# EAGLE design photonNixieTop (EAGLE 9.0.0)
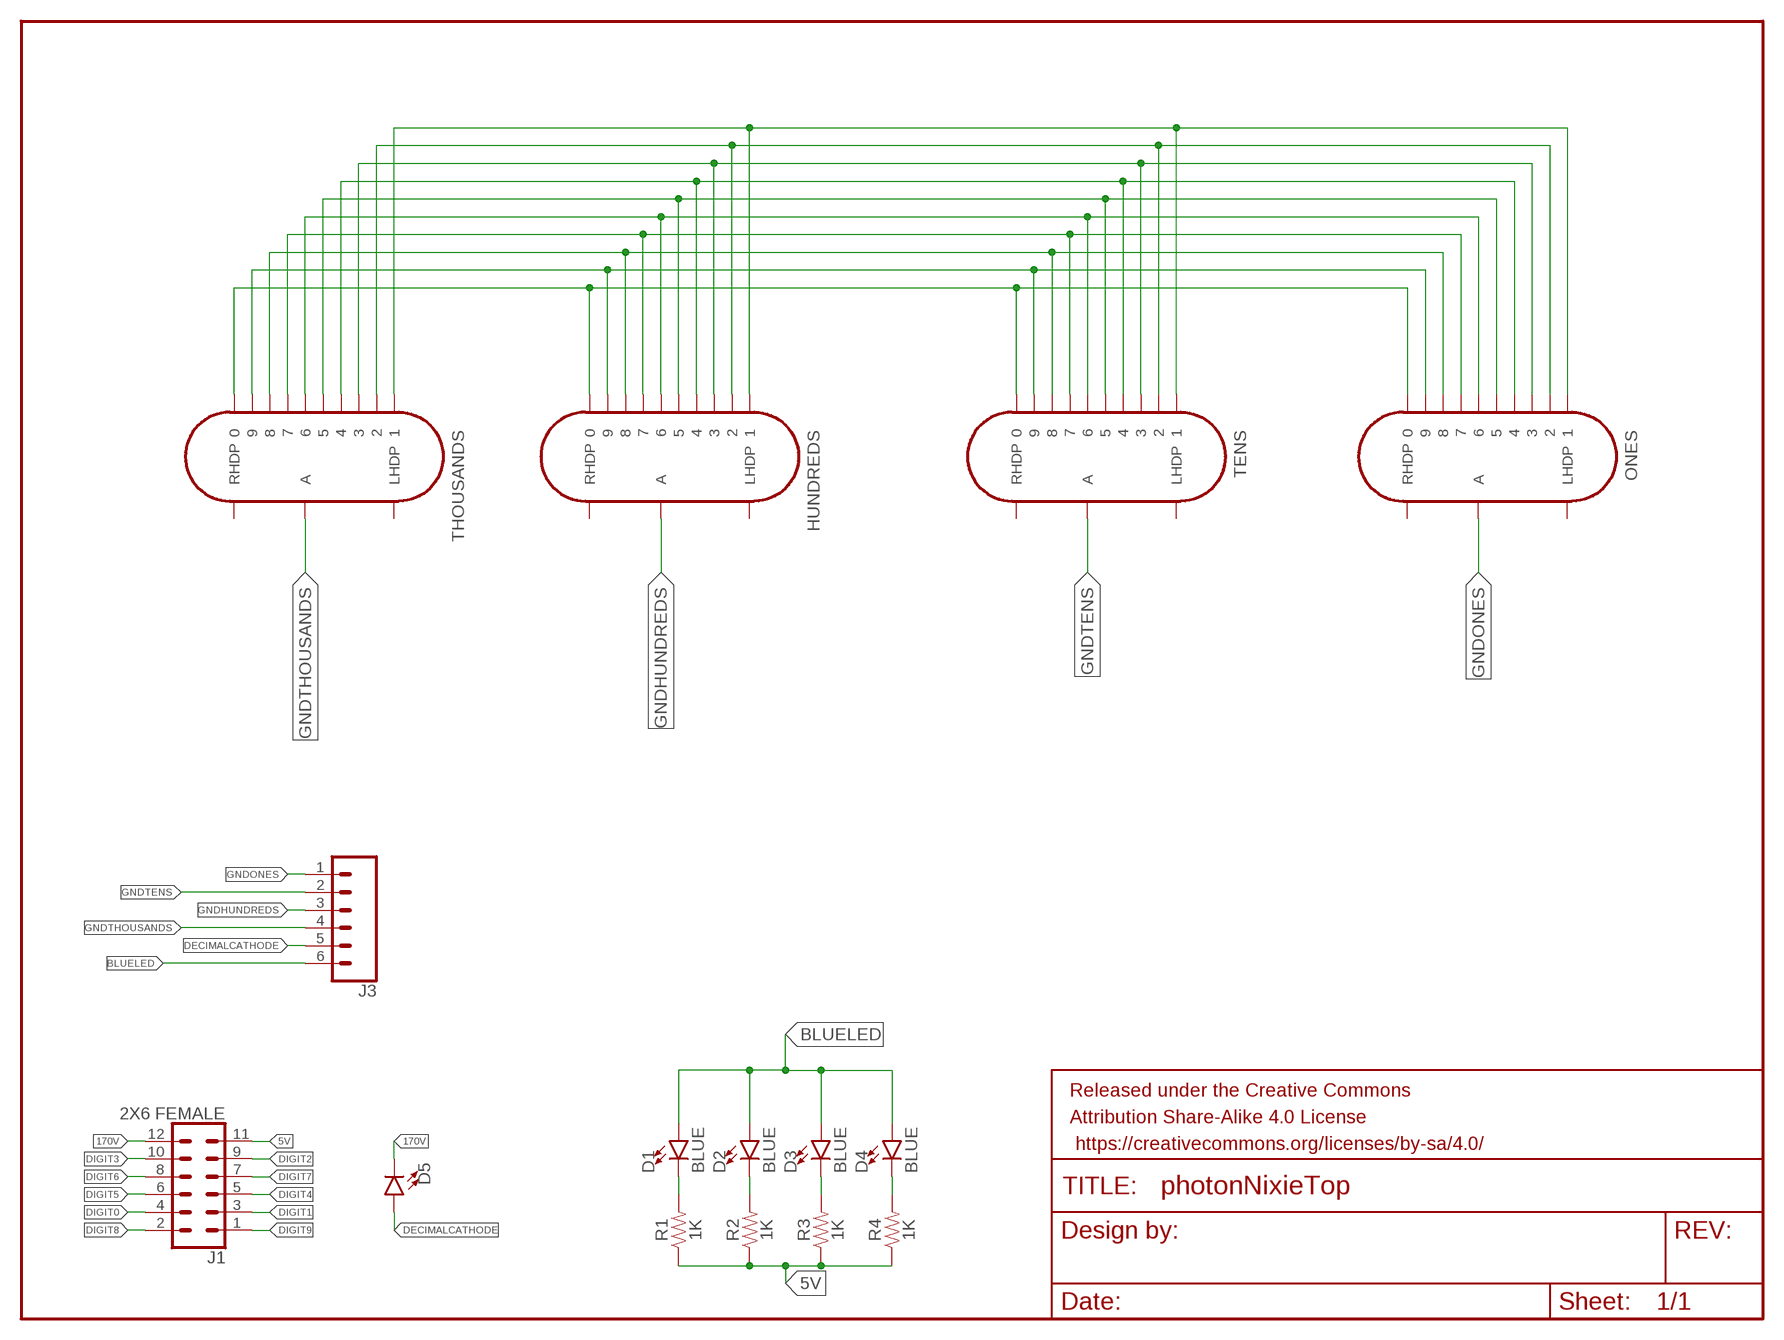
[diagram p0: schematic, sheet 1]

## Parts
D1  BLUE  LED-BLUE1206  [LED-1206]
D2  BLUE  LED-BLUE1206  [LED-1206]
D3  BLUE  LED-BLUE1206  [LED-1206]
D4  BLUE  LED-BLUE1206  [LED-1206]
D5  LED5MM  [LED_5MM]
FRAME1  FRAME-LETTER  [CREATIVE_COMMONS]
HUNDREDS  IN-14  [IN-14]
J1  2X6 FEMALE  CONN_06X2PTH_FEMALE  [2X6]
J3  CONN_06SILK_FEMALE_PTH  [1X06]
ONES  IN-14  [IN-14]
R1  1K  0.3OHM-0805-1/8W-1%  [0805]
R2  1K  0.3OHM-0805-1/8W-1%  [0805]
R3  1K  0.3OHM-0805-1/8W-1%  [0805]
R4  1K  0.3OHM-0805-1/8W-1%  [0805]
TENS  IN-14  [IN-14]
THOUSANDS  IN-14  [IN-14]

## Nets
5V: J1.11 R1.1 R2.1 R3.1 R4.1
170V: D5.K(C) J1.12
BLUELED: D1.A D2.A D3.A D4.A J3.6
DECIMALCATHODE: D5.A J3.5
DIGIT0: HUNDREDS.0 J1.4 ONES.0 TENS.0 THOUSANDS.0
DIGIT1: HUNDREDS.1 J1.3 ONES.1 TENS.1 THOUSANDS.1
DIGIT2: HUNDREDS.2 J1.9 ONES.2 TENS.2 THOUSANDS.2
DIGIT3: HUNDREDS.3 J1.10 ONES.3 TENS.3 THOUSANDS.3
DIGIT4: HUNDREDS.4 J1.5 ONES.4 TENS.4 THOUSANDS.4
DIGIT5: HUNDREDS.5 J1.6 ONES.5 TENS.5 THOUSANDS.5
DIGIT6: HUNDREDS.6 J1.8 ONES.6 TENS.6 THOUSANDS.6
DIGIT7: HUNDREDS.7 J1.7 ONES.7 TENS.7 THOUSANDS.7
DIGIT8: HUNDREDS.8 J1.2 ONES.8 TENS.8 THOUSANDS.8
DIGIT9: HUNDREDS.9 J1.1 ONES.9 TENS.9 THOUSANDS.9
GNDHUNDREDS: HUNDREDS.A J3.3
GNDONES: J3.1 ONES.A
GNDTENS: J3.2 TENS.A
GNDTHOUSANDS: J3.4 THOUSANDS.A
N$2: D4.C R4.2
N$3: D3.C R3.2
N$4: D2.C R2.2
N$5: D1.C R1.2
Unconnected: HUNDREDS.LHDP HUNDREDS.RHDP ONES.LHDP ONES.RHDP TENS.LHDP TENS.RHDP THOUSANDS.LHDP THOUSANDS.RHDP

## Library data of the parts
D1-D4 = SparkFun-LED:LED-BLUE: Blue SMD LED Used in manufacturing of various products at SparkFun Packages: 0603 - SMD 0603 package [Product Link] <http://www.digikey.com/product-detail/en/SMLE12BC7TT86/511-1589-2-ND/1641808> 1206 - SMD1206 package [Product Link] <http://www.digikey.com/product-detail/en/lite-on-inc/LTST-C150TBKT/160-1643-1-ND/573584> SparkFun Products: ESP8266 Thing-Dev Board <https://www.sparkfun.com/products/13711> RedBoard <https://www.sparkfun.com/products/12757>; PROD_ID: DIO-09911
D5 = SparkFun-LED:LED: LED (Generic) Standard schematic elements and footprints for 5mm, 3mm, 1206, and 0603 sized LEDs. Generic LEDs with no color specified.
FRAME1 = SparkFun-Aesthetics:FRAME-LETTER: Schematic Frame - Letter Standard 8.5x11 US Letter frame
HUNDREDS ONES TENS THOUSANDS = russian-nixies:IN-14: IN-14: medium numeric frontview nixie tube
J1 = SparkFun-Connectors:CONN_06X2: Multi connection point. Often used as Generic Header-pin footprint for 0.1 inch spaced/style header connections On any of the 0.1 inch spaced packages, you can populate with these: Break Away Headers - Straight <https://www.sparkfun.com/products/116> (PRT-00116) Break Away Male Headers - Right Angle <https://www.sparkfun.com/products/553> (PRT-00553) Female Headers <https://www.sparkfun.com/products/115> (PRT-00115) Break Away Headers - Machine Pin <https://www.sparkfun.com/products/117> (PRT-00117) Break Away Female Headers - Swiss Machine Pin <https://www.sparkfun.com/products/743> (PRT-00743); PROD_ID: CONN-12423
J3 = SparkFun-Connectors:CONN_06: Multi connection point. Often used as Generic Header-pin footprint for 0.1 inch spaced/style header connections On any of the 0.1 inch spaced packages, you can populate with these: Break Away Headers - Straight <https://www.sparkfun.com/products/116> (PRT-00116) Break Away Male Headers - Right Angle <https://www.sparkfun.com/products/553> (PRT-00553) Female Headers <https://www.sparkfun.com/products/115> (PRT-00115) Break Away Headers - Machine Pin <https://www.sparkfun.com/products/117> (PRT-00117) Break Away Female Headers - Swiss Machine Pin <https://www.sparkfun.com/products/743> (PRT-00743) Arduino Stackable Header - 6 Pin <https://www.sparkfun.com/products/9280> (PRT-09280) For SCREWTERMINALS and SPRING TERMINALS visit here: Screw Terimnals on SparkFun.com <https://www.sparkfun.com/search/results?term=Screw+Terminals> (5mm/3.5mm/2.54mm spacing) This device is also useful as a general connection point to wire up your design to another part of your project. Our various solder wires solder well into these plated through hole pads. Hook-Up Wire - Assortment (Stranded, 22 AWG) <https://www.sparkfun.com/products/11375> (PRT-11375) Hook-Up Wire - Assortment (Solid Core, 22 AWG) <https://www.sparkfun.com/products/11367> (PRT-11367) View the entire wire category on our website here <https://www.sparkfun.com/categories/141>; PROD_ID: CONN-08437
R1-R4 = SparkFun-Resistors:0.3OHM: 0.3Ω resistor A resistor is a passive two-terminal electrical component that implements electrical resistance as a circuit element. Resistors act to reduce current flow, and, at the same time, act to lower voltage levels within circuits. - Wikipedia; PROD_ID: RES-11622; VALUE: 0.3

## Board
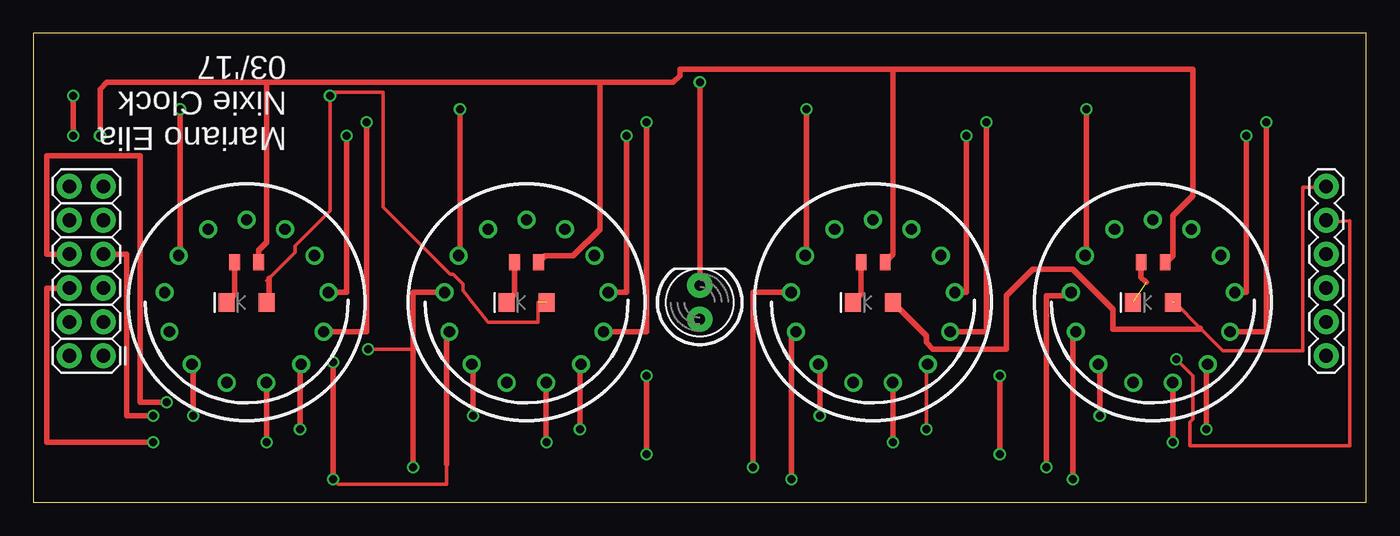
[diagram p1: board, top side]
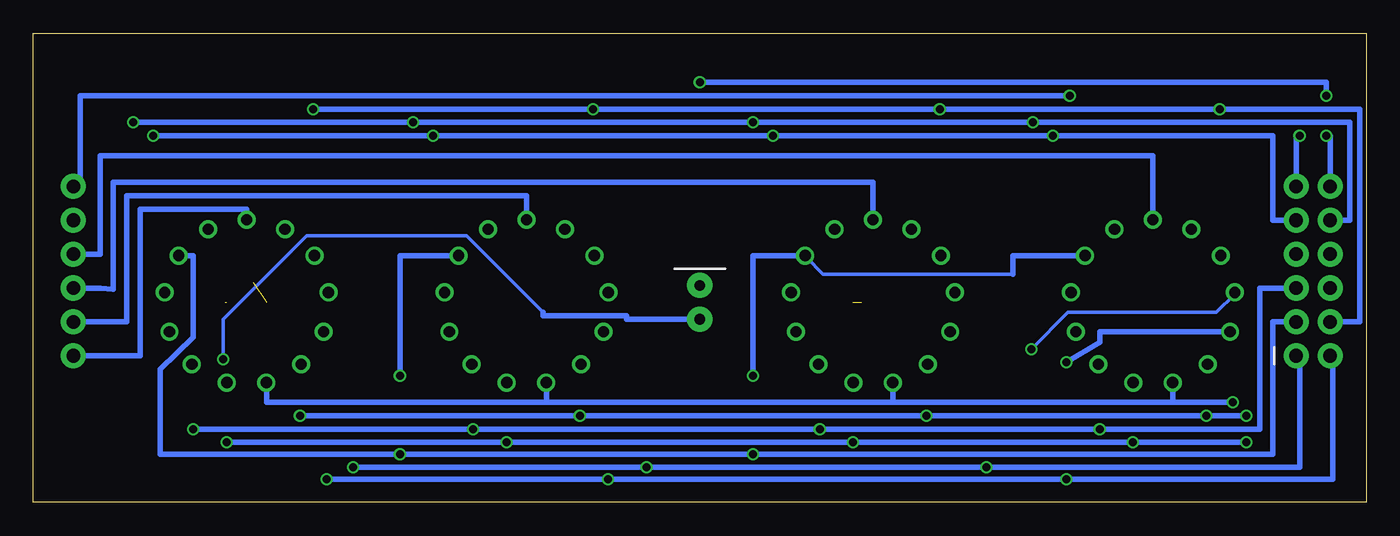
[diagram p2: board, bottom side, seen from below]

Size 100 x 35.18 mm. Coordinates in mm from the lower left corner, seen from the top.
Outline: 0,0 100,0 100,35.18 0,35.18 0,0
Copper layers (1*16): Top 0.035mm / dielectric 1.5mm / Bottom 0.035mm
Design rules "dirt_cheap_dirty_boards.v1": minimum track width 5mil, minimum drill 12mil, track to track 5mil, track to pad 5mil, pad to pad 5mil, via to via 5mil, smd to smd 0mil, copper to edge 10mil, drill to drill 10mil, minimum pad ring 10mil, minimum via ring 6mil, stop-mask expansion 2mil, vias tented up to drill 25mil, thermal gap 10mil

### Footprints (pad centres in the part's own frame; a part is rotated, then mirrored left to right if it is on the bottom)
LED-1206 = smd 1.2 x 1.4: A -1.5,0; C 1.5,0
LED_5MM = drill 0.813 pad 1.88: A -1.27,0; K 1.27,0
IN-14 = drill 0.84: 0 5.094,-3.516; 1 -5.094,-3.516; 2 -6.145,-0.746; 3 -5.788,2.195; 4 -4.105,4.633; 5 -1.481,6.01; 6 1.481,6.01; 7 4.105,4.633; 8 5.788,2.195; 9 6.145,-0.746; A 0,-6.19; LHDP 2.877,-5.481; RHDP -2.877,-5.481
2X6 = drill 1.016 pad 1.88: 1 0,0; 2 0,2.54; 3 2.54,0; 4 2.54,2.54; 5 5.08,0; 6 5.08,2.54; 7 7.62,0; 8 7.62,2.54; 9 10.16,0; 10 10.16,2.54; 11 12.7,0; 12 12.7,2.54
1X06 = drill 1.016 pad 1.88: 1 0,0; 2 2.54,0; 3 5.08,0; 4 7.62,0; 5 10.16,0; 6 12.7,0
0805 = smd 0.8 x 1.2: 1 -0.9,0; 2 0.9,0

### Placement (x,y rotation side)
D1  16,15 180 top
D2  37,15 180 top
D3  63,15 180 top
D4  84,15 180 top
D5  50,15 90 top
FRAME1  14.5,-7.5 0 top  (outside the outline)
HUNDREDS  37,15 180 top
J1  5.25,11 90 top
J3  97,11 90 top
ONES  84,15 180 top
R1  16,18 180 top
R2  37,18 180 top
R3  63,18 180 top
R4  84,18 180 top
TENS  63,15 180 top
THOUSANDS  16,15 180 top

### Tracks (layer width: path | path; a pad name or v marks a point on that pad's centre or on a via)
5V  (via drill 0.6)
  Top 0.406: v5,27.5 5,31 5.5,31.5 17.5,31.5 | R4.1 85,18 85.5,18.5 85.5,21.5 87,23 87,32.5 64.5,32.5 | 17.5,31.5 42.5,31.5 | 42.5,31.5 48,31.5 48.5,32 48.5,32.5 64.5,32.5 | R3.1 64.5,18.6 64.5,32.5 | R2.1 38.4,18.5 40.5,18.5 42.5,20.5 42.5,31.5 | R1.1 16.9,18.9 17.5,19.5 17.5,31.5
  Bottom 0.406: J1.11 5.25,27.25 v5,27.5
170V  (via drill 0.6)
  Top 0.406: v3,30.5 v3,27.5 | v50,31.5 D5.K
  Bottom 0.406: v3,30.5 3,31.5 v50,31.5 | v3,27.5 2.71,27.5 J1.12
BLUELED  (via drill 0.6)  (2 unrouted)
  Top 0.254: 17.5,16.62 17.69,16.81 19.62,18.75 19.62,19.25 22.25,21.88 v22.25,30.5 22.25,30.75 26.25,30.75 26.25,22.12 31.25,17.12 31.5,17.12 32.25,16.38 32.25,15.88 34.12,13.5 37.88,13.5 37.88,15 | 85.62,15 87.56,13.06 89.25,11.38 95.25,11.38 95.25,23.62 97,23.62 J3.6
  Top 0.406: 17.69,16.81 17.69,15.19 D1.A | D3.A 67,12.5 67,12 67.5,11.5 73,11.5 73,15.5 75,17.5 78,17.5 81,14.5 81,13 87.5,13 87.56,13.06
  Bottom 0.406: J3.6 96.5,23.7 96.5,30.5 v22.25,30.5
DECIMALCATHODE  (via drill 0.6)
  Top 0.254: v85.75,10.75 87,9.5 87,6.25 86.75,6 86.75,4.25 98.75,4.25 98.75,21.12 97,21 J3.5
  Bottom 0.254: 61.75,14.25 67.5,20 79.5,20 85.75,13.75 v85.75,10.75
  Bottom 0.406: D5.A 55.5,13.73 55.5,14 61.75,14 61.75,14.25
DIGIT0  (via drill 0.6)
  Top 0.406: ONES.0 79,18.52 v79,29.5 | TENS.0 58,18.52 v58,29.5 | HUNDREDS.0 32,18.52 v32,29.5 | THOUSANDS.0 11,18.52 v11,29.5
  Bottom 0.406: v79,29.5 v58,29.5 v32,29.5 v11,29.5 0.5,29.5 0.5,13.54 J1.4
DIGIT1  (via drill 0.6)
  Top 0.406: v46,9.5 v46,3.62 | v72.5,9.5 v72.5,3.62
  Bottom 0.254: 26.5,17.12 40.75,17.12 42,18.38 HUNDREDS.1
  Bottom 0.406: J1.3 7,13.54 7,3.62 v46,3.62 v72.5,3.62 90.5,3.62 90.5,10 88,12.38 88,18.52 ONES.1 | THOUSANDS.1 26.5,18.52 26.5,17.12 | HUNDREDS.1 46,18.52 v46,9.5 | TENS.1 72.5,18.52 v72.5,9.5
DIGIT2  (via drill 0.6)
  Top 0.406: THOUSANDS.2 23.5,15.75 v23.5,27.5 | HUNDREDS.2 44.5,15.75 v44.5,27.5 | TENS.2 70,15.75 v70,27.5 | ONES.2 91,15.75 v91,27.5
  Bottom 0.406: J1.9 7,21.16 7,27.5 v23.5,27.5 v44.5,27.5 v70,27.5 v91,27.5
DIGIT3  (via drill 0.6)
  Top 0.406: THOUSANDS.3 25,12.8 v25,28.5 | HUNDREDS.3 46,12.8 v46,28.5 | TENS.3 71.5,12.8 v71.5,28.5 | ONES.3 92.5,12.8 v92.5,28.5
  Bottom 0.406: J1.10 1.25,21.16 1.25,28.5 v25,28.5 v46,28.5 v71.5,28.5 v92.5,28.5
DIGIT4  (via drill 0.6)
  Top 0.254: v67,5.5 67,10.25 TENS.4
  Top 0.406: THOUSANDS.4 20,10.37 v20,5.5 | HUNDREDS.4 41,10.37 v41,5.5 | ONES.4 88,10.37 v88,5.5
  Bottom 0.406: J1.5 8,16.08 8,5.5 v20,5.5 v41,5.5 v67,5.5 v88,5.5
DIGIT5  (via drill 0.6)
  Top 0.406: J1.6 1,16.08 1,4.5 v9,4.5 | THOUSANDS.5 17.5,8.99 v17.5,4.5 | v38.5,4.5 38.48,4.5 HUNDREDS.5 | v64.5,4.5 64.48,4.5 TENS.5 | v85.5,4.5 85.48,4.5 ONES.5
  Bottom 0.406: v9,4.5 v17.5,4.5 v38.5,4.5 v64.5,4.5 v85.5,4.5
DIGIT6  (via drill 0.6)
  Top 0.406: J1.8 1,18.62 1,26 8,26 8,7.5 v10,7.5
  Bottom 0.406: 14.5,7.5 v10,7.5 | 35.5,7.5 14.5,7.5 | 61.5,7.5 35.5,7.5 | 61.5,7.5 82.5,7.5 82.5,8.99 ONES.6 | THOUSANDS.6 14.5,8.99 14.5,7.5 | HUNDREDS.6 35.5,8.99 35.5,7.5 | TENS.6 61.5,8.99 61.5,7.5
DIGIT7  (via drill 0.6)
  Top 0.406: J1.7 7,18.62 7,6.5 v9,6.5 | THOUSANDS.7 12,10.37 v12,6.5 | ONES.7 80,10.37 v80,6.5 | TENS.7 59,10.37 v59,6.5 | HUNDREDS.7 33,10.37 v33,6.5
  Bottom 0.406: v9,6.5 v12,6.5 v33,6.5 v59,6.5 v80,6.5
DIGIT8  (via drill 0.6)
  Top 0.254: 31,2.88 31,1.38 22.88,1.38 v22.5,1.75
  Top 0.406: TENS.8 56.88,12.8 v56.88,1.75 | ONES.8 78,12.8 v78,1.75 | HUNDREDS.8 31,12.8 31,2.88 | v22.5,10.5 v22.5,1.75
  Bottom 0.406: J1.2 2.5,11 2.5,1.75 v22.5,1.75 v56.88,1.75 v78,1.75 | THOUSANDS.8 20,12.8 20,12 v22.5,10.5
DIGIT9  (via drill 0.6)
  Top 0.254: 28.5,11.5 v25.12,11.5 | v28.5,2.62
  Top 0.406: v76,2.62 76,15.5 77.86,15.5 ONES.9 | HUNDREDS.9 28.5,15.75 28.5,11.5 v28.5,2.62 28.5,2.56 | TENS.9 54,15.75 v54,2.62
  Bottom 0.254: v25.12,11.5 22.38,14.25 11.25,14.25 9.88,15.62 THOUSANDS.9
  Bottom 0.406: J1.1 5,11 5,2.62 v28.5,2.62 v54,2.62 v76,2.62
GNDHUNDREDS
  Bottom 0.406: J3.3 95,16.08 94,16 94,24 37,24 HUNDREDS.A
GNDONES
  Bottom 0.406: J3.1 92,11 92,22 84,22 ONES.A
GNDTENS
  Bottom 0.406: J3.2 93,13.54 93,23 63,23 TENS.A
GNDTHOUSANDS
  Bottom 0.406: J3.4 95,18.62 95,26 16,26 THOUSANDS.A
N$2  (1 unrouted)
  Top 0.406: R4.2 83.1,16.9 83.5,16.5
N$3
  Top 0.406: R3.2 62.1,15.6 D3.C
N$4
  Top 0.406: D2.C 36.1,15.6 R2.2
N$5
  Top 0.406: R1.2 15.1,15.6 D1.C

### Text on the board
tNames: Mariano Elia / Nixie Clock / 03/'17